# Altium project sensored-bldc-driver-pcb.PrjPcb
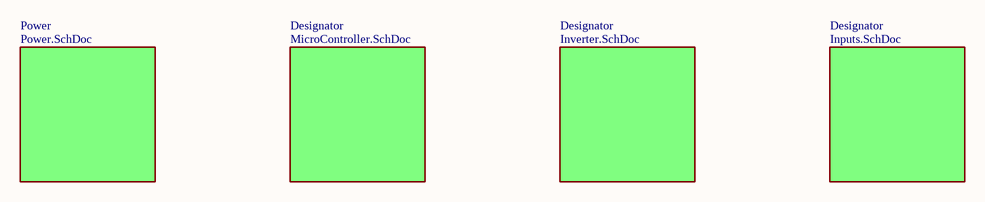
[diagram p0: Sensored BLDC Driver PCB.SchDoc]
5 sheets, 152 parts. Net scope: global (net labels, ports and power ports of the same name join across sheets).
Sheets:
  Sensored BLDC Driver PCB.SchDoc
    Power = Power.SchDoc
    Designator = MicroController.SchDoc
    Designator = Inverter.SchDoc
    Designator = Inputs.SchDoc

## Sheet Sensored BLDC Driver PCB.SchDoc
size A4; SheetNumber: 1; SheetTotal: 5

### Sub-sheets
Designator = MicroController.SchDoc: no entries
Designator = Inverter.SchDoc: no entries
Designator = Inputs.SchDoc: no entries
Power = Power.SchDoc: no entries

## Sheet Power.SchDoc
size A3; SheetNumber: 2; SheetTotal: 5
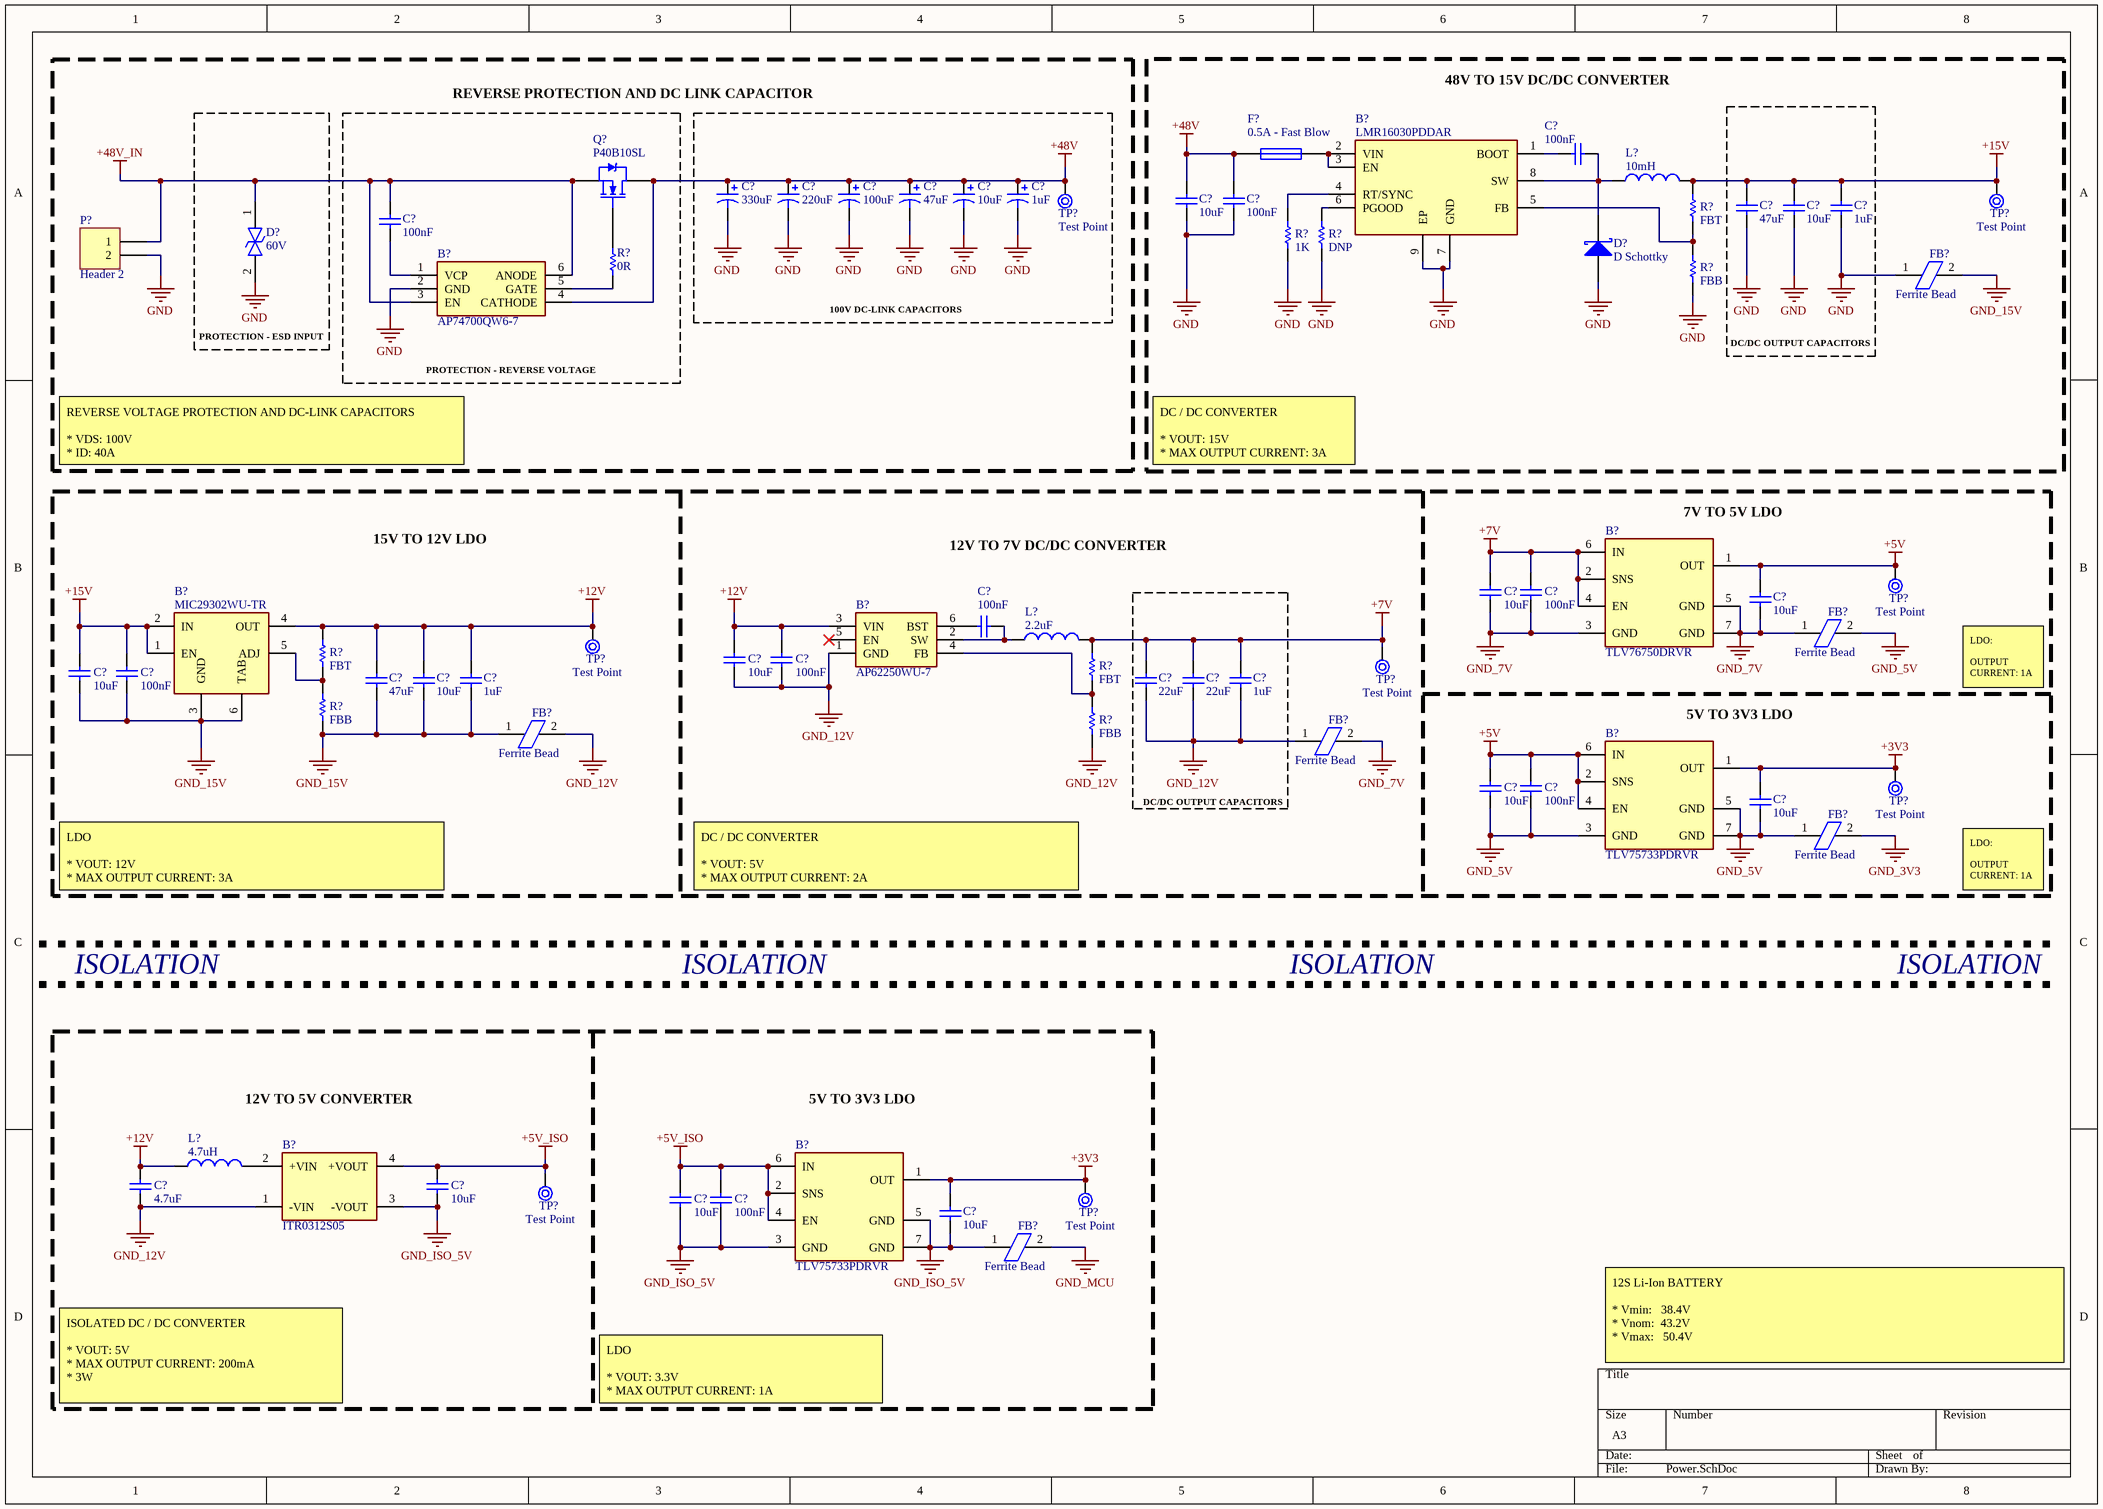
[diagram p1: Power.SchDoc]

### Parts
(Parts that share a designator on the sheet are numbered #1, #2 ... from top to bottom, then left to right.)
B?#1  LMR16030PDDAR
B?#2  AP74700QW6-7
B?#3  TLV76750DRVR  [WSON-6]
B?#4  AP62250WU-7  [TSOT-26-6]
B?#5  MIC29302WU-TR  [TO263-5]
B?#6  TLV75733PDRVR  [WSON-6]
B?#7  TLV75733PDRVR  [WSON-6]
B?#8  ITR0312S05  [SIP-4]
C?#1  value 100nF  (hidden comment: Cap)
C?#2  value 330uF  (hidden comment: Cap Pol2)
C?#3  value 220uF  (hidden comment: Cap Pol2)
C?#4  value 100uF  (hidden comment: Cap Pol2)
C?#5  value 47uF  (hidden comment: Cap Pol2)
C?#6  value 10uF  (hidden comment: Cap Pol2)
C?#7  value 1uF  (hidden comment: Cap Pol2)
C?#8  value 10uF  (hidden comment: Cap)
C?#9  value 100nF  (hidden comment: Cap)
C?#10  value 47uF  (hidden comment: Cap)
C?#11  value 10uF  (hidden comment: Cap)
C?#12  value 1uF  (hidden comment: Cap)
C?#13  value 100nF  (hidden comment: Cap)
C?#14  value 10uF  (hidden comment: Cap)
C?#15  value 100nF  (hidden comment: Cap)
C?#16  value 10uF  (hidden comment: Cap)
C?#17  value 100nF  (hidden comment: Cap)
C?#18  value 10uF  (hidden comment: Cap)
C?#19  value 100nF  (hidden comment: Cap)
C?#20  value 10uF  (hidden comment: Cap)
C?#21  value 100nF  (hidden comment: Cap)
C?#22  value 47uF  (hidden comment: Cap)
C?#23  value 10uF  (hidden comment: Cap)
C?#24  value 1uF  (hidden comment: Cap)
C?#25  value 22uF  (hidden comment: Cap)
C?#26  value 22uF  (hidden comment: Cap)
C?#27  value 1uF  (hidden comment: Cap)
C?#28  value 10uF  (hidden comment: Cap)
C?#29  value 100nF  (hidden comment: Cap)
C?#30  value 10uF  (hidden comment: Cap)
C?#31  value 4.7uF  (hidden comment: Cap)
C?#32  value 10uF  (hidden comment: Cap)
C?#33  value 10uF  (hidden comment: Cap)
C?#34  value 100nF  (hidden comment: Cap)
C?#35  value 10uF  (hidden comment: Cap)
D?#1  60V
D?#2  D Schottky
F?  0.5A - Fast Blow
FB?#1  Ferrite Bead
FB?#2  Ferrite Bead
FB?#3  Ferrite Bead
FB?#4  Ferrite Bead
FB?#5  Ferrite Bead
FB?#6  Ferrite Bead
L?#1  value 10mH  (hidden comment: Inductor)
L?#2  value 2.2uF  (hidden comment: Inductor)
L?#3  value 4.7uH  (hidden comment: Inductor)
P?  Header 2  [HDR1X2]
Q?#1  P40B10SL
R?#1  value FBT  (hidden comment: Res Small)
R?#2  value 0R  (hidden comment: Res Small)
R?#3  value 1K  (hidden comment: Res Small)
R?#4  value DNP  (hidden comment: Res Small)
R?#5  value FBB  (hidden comment: Res Small)
R?#6  value FBT  (hidden comment: Res Small)
R?#7  value FBT  (hidden comment: Res Small)
R?#8  value FBB  (hidden comment: Res Small)
R?#9  value FBB  (hidden comment: Res Small)
TP?#1  Test Point
TP?#2  Test Point
TP?#3  Test Point
TP?#4  Test Point
TP?#5  Test Point
TP?#6  Test Point
TP?#7  Test Point
TP?#8  Test Point

### Blocks framed on the sheet
REVERSE PROTECTION AND DC LINK CAPACITOR: P?
48V TO 15V DC/DC CONVERTER: B?#1 C?#1 C?#8 C?#9 D?#2 F? FB?#1 L?#1 R?#1 R?#3-R?#5 TP?#2
PROTECTION - ESD INPUT: D?#1
PROTECTION - REVERSE VOLTAGE: B?#2 C?#13 Q?#1 R?#2
100V DC-LINK CAPACITORS: C?#2-C?#7 TP?#1
DC/DC OUTPUT CAPACITORS: C?#10-C?#12
DC/DC OUTPUT CAPACITORS: C?#25-C?#27

### Nets
+3V3: B?#6.1(OUT) B?#7.1(OUT) C?#30.1 C?#35.1 TP?#6.1 TP?#8.1
+5V: B?#3.1(OUT) B?#6.2(SNS) B?#6.4(EN) B?#6.6(IN) C?#16.1 C?#28.1 C?#29.1 TP?#3.1
+5V_ISO: B?#7.2(SNS) B?#7.4(EN) B?#7.6(IN) B?#8.4(+VOUT) C?#32.1 C?#33.1 C?#34.1 TP?#7.1
+7V: B?#3.2(SNS) B?#3.4(EN) B?#3.6(IN) C?#14.1 C?#15.1 C?#25.1 C?#26.1 C?#27.1 L?#2.2 R?#7.2 TP?#5.1
+12V: B?#4.3(VIN) B?#5.4(OUT) C?#18.1 C?#19.1 C?#22.1 C?#23.1 C?#24.1 C?#31.1 L?#3.1 R?#6.2 TP?#4.1
+15V: B?#5.1(EN) B?#5.2(IN) C?#10.1 C?#11.1 C?#12.1 C?#20.1 C?#21.1 L?#1.2 R?#1.2 TP?#2.1
+48V: B?#2.4(CATHODE) C?#2.1 C?#3.1 C?#4.1 C?#5.1 C?#6.1 C?#7.1 C?#8.1 C?#9.1 F?.1 Q?#1.2(D) TP?#1.1
+48V_IN: B?#2.3(EN) B?#2.6(ANODE) C?#13.1 D?#1.1 P?.1 Q?#1.3(S)
GND: B?#1.7(GND) B?#1.9(EP) B?#2.2(GND) C?#2.2 C?#3.2 C?#4.2 C?#5.2 C?#6.2 C?#7.2 C?#8.2 C?#9.2 C?#10.2 C?#11.2 C?#12.2 D?#1.2 D?#2.1(A) FB?#1.1 P?.2 R?#3.1 R?#4.1 R?#5.1
GND_3V3: FB?#5.2
GND_5V: B?#6.3(GND) B?#6.5(GND) B?#6.7(GND) C?#28.2 C?#29.2 C?#30.2 FB?#2.2 FB?#5.1
GND_7V: B?#3.3(GND) B?#3.5(GND) B?#3.7(GND) C?#14.2 C?#15.2 C?#16.2 FB?#2.1 FB?#4.2
GND_12V: B?#4.1(GND) B?#8.1(-VIN) C?#18.2 C?#19.2 C?#25.2 C?#26.2 C?#27.2 C?#31.2 FB?#3.2 FB?#4.1 R?#9.1
GND_15V: B?#5.3(GND) B?#5.6(TAB) C?#20.2 C?#21.2 C?#22.2 C?#23.2 C?#24.2 FB?#1.2 FB?#3.1 R?#8.1
GND_ISO_5V: B?#7.3(GND) B?#7.5(GND) B?#7.7(GND) B?#8.3(-VOUT) C?#32.2 C?#33.2 C?#34.2 C?#35.2 FB?#6.1
GND_MCU: FB?#6.2
NetB?#1_1: B?#1.1(BOOT) C?#1.1
NetB?#1_2: B?#1.2(VIN) B?#1.3(EN) F?.2
NetB?#1_4: B?#1.4(RT/SYNC) R?#3.2
NetB?#1_5: B?#1.5(FB) R?#1.1 R?#5.2
NetB?#1_6: B?#1.6(PGOOD) R?#4.2
NetB?#1_8: B?#1.8(SW) C?#1.2 D?#2.2(K) L?#1.1
NetB?#2_1: B?#2.1(VCP) C?#13.2
NetB?#2_5: B?#2.5(GATE) R?#2.2
NetB?#4_2: B?#4.2(SW) C?#17.2 L?#2.1
NetB?#4_4: B?#4.4(FB) R?#7.1 R?#9.2
NetB?#4_6: B?#4.6(BST) C?#17.1
NetB?#5_5: B?#5.5(ADJ) R?#6.1 R?#8.2
NetB?#8_2: B?#8.2(+VIN) L?#3.2
NetQ?#1_1: Q?#1.1(G) R?#2.1

Not connected (* = marked no-connect by the designer): B?#4 5(EN)*

### Notes on the sheet
- REVERSE VOLTAGE PROTECTION AND DC-LINK CAPACITORS
  * VDS: 100V
  * ID: 40A
- DC / DC CONVERTER
  * VOUT: 15V
  * MAX OUTPUT CURRENT: 3A
- (near B?#3) 7V TO 5V LDO
- 15V TO 12V LDO
- 12V TO 7V DC/DC CONVERTER
- (near B?#6) 5V TO 3V3 LDO
- LDO:
  OUTPUT CURRENT: 1A
- LDO
  * VOUT: 12V
  * MAX OUTPUT CURRENT: 3A
- DC / DC CONVERTER
  * VOUT: 5V
  * MAX OUTPUT CURRENT: 2A
- ISOLATION
- 12V TO 5V CONVERTER
- 5V TO 3V3 LDO
- ISOLATED DC / DC CONVERTER
  * VOUT: 5V
  * MAX OUTPUT CURRENT: 200mA
  * 3W
- LDO
  * VOUT: 3.3V
  * MAX OUTPUT CURRENT: 1A
- 12S Li-Ion BATTERY
  * Vmin:   38.4V
  * Vnom:  43.2V
  * Vmax:   50.4V

### Library data of the parts
B?#1 = LMR16030PDDAR: Switching Voltage Regulators SIMPLE SWITCHER 60V, 3A Step-Down Converter with 40uA Iq 8-SO PowerPAD -40 to 125
B?#2 = AP74700QW6-7: Power Switch ICs - Power Distribution Load Switch SOT26 T&R 3K; Manufacturer_Name: Diodes Incorporated; Geometry.Height: 1.4mm; Manufacturer_Part_Number: AP74700QW6-7; Mouser Part Number: 621-AP74700QW6-7; Mouser Price/Stock: https://www.mouser.co.uk/ProductDetail/Diodes-Incorporated/AP74700QW6-7?qs=vvQtp7zwQdPsSFAXTBJZqQ%3D%3D; Arrow Part Number: AP74700QW6-7; Arrow Price/Stock: https://www.arrow.com/en/products/ap74700qw6-7/diodes-incorporated?region=nac; Datasheet Link: https://www.diodes.com//assets/Datasheets/AP74700Q.pdf
B?#3 = TLV76750DRVR: LDO Voltage Regulators Adjustable- and fixed-output, 1-A, 16-V, positive-voltage low-dropout (LDO) linear regulator 6-WSON -40 to 125
B?#4 = AP62250WU-7: Buck Switching Regulator IC Positive Adjustable 0.8V 1 Output 2.5A SOT-23-6 Thin, TSOT-23-6
B?#5 = MIC29302WU-TR: Microchip MIC29302WU-TR, LDO Regulator, 3A Adjustable, +/-2%, 2.25  26 Vin 5-Pin D2PAK; Geometry.Height: 4.597mm; Arrow Price/Stock: https://www.arrow.com/en/products/mic29302wu-tr/microchip-technology?region=nac; Datasheet Link: http://ww1.microchip.com/downloads/en/DeviceDoc/20005685A.pdf
B?#6 B?#7 = TLV75733PDRVR: LDO Voltage Regulators 1-A, low-IQ high-accuracy low-dropout (LDO) voltage regulator with enable 6-WSON -40 to 125
B?#8 = ITR0312S05: Isolated DC/DC Converters - Through Hole DC-DC 3W 10% INPUT; Manufacturer_Name: RECOM Power; Manufacturer_Part_Number: RFM-0505S; Geometry.Height: 10.5mm; Mouser Part Number: 919-RFM-0505S; Mouser Price/Stock: https://www.mouser.co.uk/ProductDetail/RECOM-Power/RFM-0505S?qs=lYGu3FyN48dRVYKTH5ipqg%3D%3D; Arrow Part Number: RFM-0505S; Arrow Price/Stock: https://www.arrow.com/en/products/rfm-0505s/recom-power?region=nac; Datasheet Link: https://www.recom-power.com/pdf/Econoline/RFM.pdf
C?#1 C?#8-C?#35 = Cap: Capacitor; Published: 8-Jun-2000; LatestRevisionDate: 17-Jul-2002; LatestRevisionNote: Re-released for DXP Platform.; PackageReference: RAD-0.3; Publisher: Altium Limited; PackageDescription: Radial Cap, Thru-Hole; 2 Leads; 0.3 in Pin Spacing
C?#2-C?#7 = Cap Pol2: Polarized Capacitor (Axial); Published: 8-Jun-2000; LatestRevisionDate: 17-Jul-2002; LatestRevisionNote: Re-released for DXP Platform.; PackageReference: POLAR0.8; Publisher: Altium Limited; PackageDescription: Polarized Capacitor; 2 Leads
D?#1 = TVS: TVS  / ESD Suppressors Diodes Bi-Directional
D?#2 = D Schottky: Schottky Diode; Published: 8-Jun-2000; LatestRevisionDate: 17-Jul-2002; LatestRevisionNote: Re-released for DXP Platform.; PackageReference: SMB; Publisher: Altium Limited; PackageDescription: DO-214-AA/SMB; 2 C-Bend Leads; Body 5.3 x 3.6 mm, inc. leads (LxW); Code_JEDEC: DO-214-AA
F? = Fuse 1: Fuse; Published: 8-Jun-2000; LatestRevisionDate: 17-Jul-2002; LatestRevisionNote: Re-released for DXP Platform.; PackageReference: PIN-W2/E2.8; Publisher: Altium Limited; PackageDescription: Thru-Hole; 2 Leads
L?#1-L?#3 = Inductor: Code_IEC: 1005; Published: 8-Jun-2000; LatestRevisionDate: 29-May-2009; LatestRevisionNote: IPC-7351 Footprint Added.; PackageReference: 0402-A; Publisher: Altium Limited; PackageDescription: Chip Inductor; Code_JEITA: 0402
P? = Header 2: Header, 2-Pin; LatestRevisionDate: 17-Jul-2002; LatestRevisionNote: Re-released for DXP Platform.; Publisher: Altium Limited
Q?#1 = NMOS-2: N-Channel Power MOSFET; Note: Pin 2 is electrically connected to pin 4.; Published: 8-Jun-2000; LatestRevisionDate: 17-Jul-2002; LatestRevisionNote: Re-released for DXP Platform.; DatasheetVersion: PD-9.814; PackageVersion: Feb-1997; PackageReference: TO-220AB; Publisher: Altium Limited; PackageDescription: TO, Thru-Hole, Vertical, Heatsink Mounted; 3 In-Line Leads; Pitch 2.54 mm; ComponentLink1Description: Manufacturer Link; ComponentLink1URL: http://www.irf.com/
R?#1-R?#9 = Res Small: Resistor; Published: 8-Jun-2000; LatestRevisionDate: 17-Jul-2002; LatestRevisionNote: Re-released for DXP Platform.; PackageReference: AXIAL-0.3; Publisher: Altium Limited; PackageDescription: Axial Device, Thru-Hole; 2 Leads; 0.3 in Pin Spacing

## Sheet MicroController.SchDoc
size A4; SheetNumber: 3; SheetTotal: 5

## Sheet Inverter.SchDoc
size A3 portrait; SheetNumber: 5; SheetTotal: 5
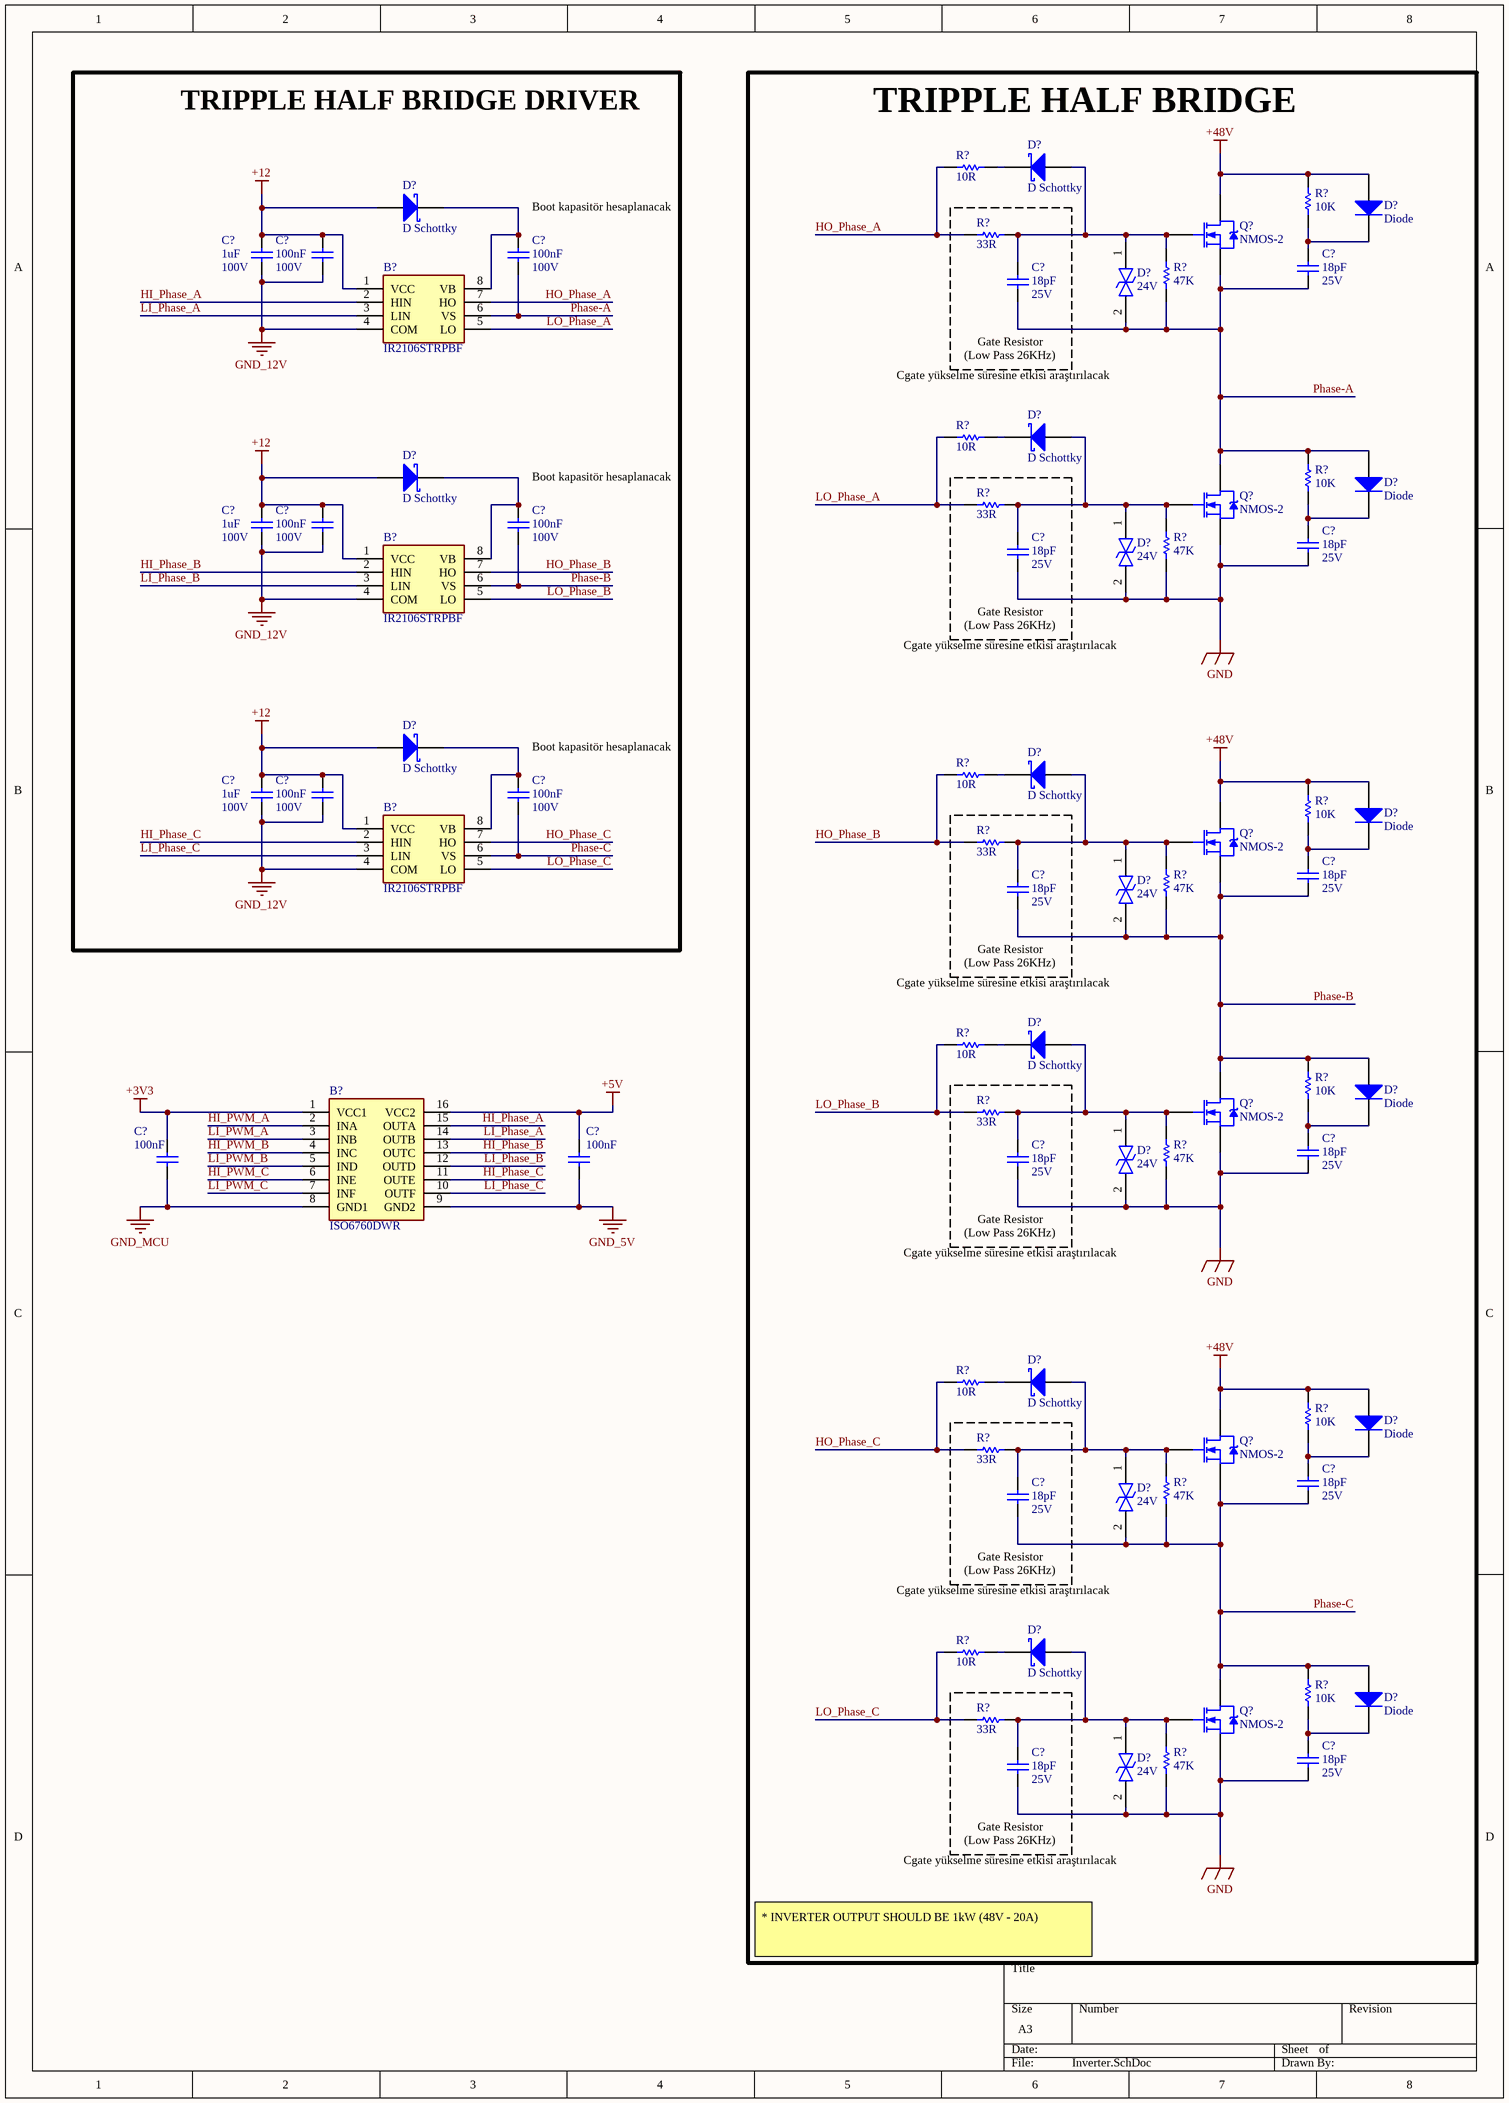
[diagram p2: Inverter.SchDoc]

### Parts
(Parts that share a designator on the sheet are numbered #1, #2 ... from top to bottom, then left to right.)
B?#9  IR2106STRPBF  [SOIC-8]
B?#10  IR2106STRPBF  [SOIC-8]
B?#11  IR2106STRPBF  [SOIC-8]
B?#12  ISO6760DWR  [SOIC-16N]
C?#36  value 1uF  Voltage: 100V  (hidden comment: Cap)
C?#37  value 100nF  Voltage: 100V  (hidden comment: Cap)
C?#38  value 100nF  Voltage: 100V  (hidden comment: Cap)
C?#39  value 18pF  Voltage: 25V  (hidden comment: Cap)
C?#40  value 18pF  Voltage: 25V  (hidden comment: Cap)
C?#41  value 1uF  Voltage: 100V  (hidden comment: Cap)
C?#42  value 100nF  Voltage: 100V  (hidden comment: Cap)
C?#43  value 100nF  Voltage: 100V  (hidden comment: Cap)
C?#44  value 18pF  Voltage: 25V  (hidden comment: Cap)
C?#45  value 18pF  Voltage: 25V  (hidden comment: Cap)
C?#46  value 1uF  Voltage: 100V  (hidden comment: Cap)
C?#47  value 100nF  Voltage: 100V  (hidden comment: Cap)
C?#48  value 100nF  Voltage: 100V  (hidden comment: Cap)
C?#49  value 18pF  Voltage: 25V  (hidden comment: Cap)
C?#50  value 18pF  Voltage: 25V  (hidden comment: Cap)
C?#51  value 18pF  Voltage: 25V  (hidden comment: Cap)
C?#52  value 100nF  (hidden comment: Cap)
C?#53  value 100nF  (hidden comment: Cap)
C?#54  value 18pF  Voltage: 25V  (hidden comment: Cap)
C?#55  value 18pF  Voltage: 25V  (hidden comment: Cap)
C?#56  value 18pF  Voltage: 25V  (hidden comment: Cap)
C?#57  value 18pF  Voltage: 25V  (hidden comment: Cap)
C?#58  value 18pF  Voltage: 25V  (hidden comment: Cap)
D?#3  D Schottky
D?#4  D Schottky
D?#5  Diode
D?#6  24V
D?#7  D Schottky
D?#8  D Schottky
D?#9  Diode
D?#10  24V
D?#11  D Schottky
D?#12  D Schottky
D?#13  Diode
D?#14  24V
D?#15  D Schottky
D?#16  Diode
D?#17  24V
D?#18  D Schottky
D?#19  Diode
D?#20  24V
D?#21  D Schottky
D?#22  Diode
D?#23  24V
Q?#2  NMOS-2
Q?#3  NMOS-2
Q?#4  NMOS-2
Q?#5  NMOS-2
Q?#6  NMOS-2
Q?#7  NMOS-2
R?#10  value 10R  (hidden comment: Res Small)
R?#11  value 10K  (hidden comment: Res Small)
R?#12  value 33R  (hidden comment: Res Small)
R?#13  value 47K  (hidden comment: Res Small)
R?#14  value 10R  (hidden comment: Res Small)
R?#15  value 10K  (hidden comment: Res Small)
R?#16  value 33R  (hidden comment: Res Small)
R?#17  value 47K  (hidden comment: Res Small)
R?#18  value 10R  (hidden comment: Res Small)
R?#19  value 10K  (hidden comment: Res Small)
R?#20  value 33R  (hidden comment: Res Small)
R?#21  value 47K  (hidden comment: Res Small)
R?#22  value 10R  (hidden comment: Res Small)
R?#23  value 10K  (hidden comment: Res Small)
R?#24  value 33R  (hidden comment: Res Small)
R?#25  value 47K  (hidden comment: Res Small)
R?#26  value 10R  (hidden comment: Res Small)
R?#27  value 10K  (hidden comment: Res Small)
R?#28  value 33R  (hidden comment: Res Small)
R?#29  value 47K  (hidden comment: Res Small)
R?#30  value 10R  (hidden comment: Res Small)
R?#31  value 10K  (hidden comment: Res Small)
R?#32  value 33R  (hidden comment: Res Small)
R?#33  value 47K  (hidden comment: Res Small)

### Blocks framed on the sheet
TRIPPLE HALF BRIDGE DRIVER: B?#9-B?#11 C?#36-C?#38 C?#41-C?#43 C?#46-C?#48 D?#4 D?#8 D?#11
TRIPPLE HALF BRIDGE: C?#39 C?#40 C?#44 C?#45 C?#49-C?#51 C?#54-C?#58 D?#3 D?#5-D?#7 D?#9 D?#10 D?#12-D?#23 Q?#2-Q?#7 R?#10-R?#33

### Nets
+3V3: B?#12.1(VCC1) C?#52.2
+5V: B?#12.16(VCC2) C?#53.2
+12: B?#9.1(VCC) B?#10.1(VCC) B?#11.1(VCC) C?#36.2 C?#37.2 C?#41.2 C?#42.2 C?#46.2 C?#47.2 D?#4.1(A) D?#8.1(A) D?#11.1(A)
+48V: D?#5.1(A) D?#13.1(A) D?#19.1(A) Q?#2.2(D) Q?#4.2(D) Q?#6.2(D) R?#11.2 R?#19.2 R?#27.2
GND: C?#44.1 C?#45.1 C?#51.1 C?#54.1 C?#57.1 C?#58.1 D?#10.2 D?#17.2 D?#23.2 Q?#3.3(S) Q?#5.3(S) Q?#7.3(S) R?#17.1 R?#25.1 R?#33.1
GND_5V: B?#12.9(GND2) C?#53.1
GND_12V: B?#9.4(COM) B?#10.4(COM) B?#11.4(COM) C?#36.1 C?#37.1 C?#41.1 C?#42.1 C?#46.1 C?#47.1
GND_MCU: B?#12.8(GND1) C?#52.1
HI_Phase_A: B?#9.2(HIN) B?#12.15(OUTA)
HI_Phase_B: B?#10.2(HIN) B?#12.13(OUTC)
HI_Phase_C: B?#11.2(HIN) B?#12.11(OUTE)
HI_PWM_A: B?#12.2(INA)
HI_PWM_B: B?#12.4(INC)
HI_PWM_C: B?#12.6(INE)
HO_Phase_A: B?#9.7(HO) R?#10.2 R?#12.2
HO_Phase_B: B?#10.7(HO) R?#18.2 R?#20.2
HO_Phase_C: B?#11.7(HO) R?#26.2 R?#28.2
LI_Phase_A: B?#9.3(LIN) B?#12.14(OUTB)
LI_Phase_B: B?#10.3(LIN) B?#12.12(OUTD)
LI_Phase_C: B?#11.3(LIN) B?#12.10(OUTF)
LI_PWM_A: B?#12.3(INB)
LI_PWM_B: B?#12.5(IND)
LI_PWM_C: B?#12.7(INF)
LO_Phase_A: B?#9.5(LO) R?#14.2 R?#16.2
LO_Phase_B: B?#10.5(LO) R?#22.2 R?#24.2
LO_Phase_C: B?#11.5(LO) R?#30.2 R?#32.2
Phase-A: B?#9.6(VS) C?#38.1 C?#39.1 C?#40.1 D?#6.2 D?#9.1(A) Q?#2.3(S) Q?#3.2(D) R?#13.1 R?#15.2
Phase-B: B?#10.6(VS) C?#43.1 C?#49.1 C?#50.1 D?#14.2 D?#16.1(A) Q?#4.3(S) Q?#5.2(D) R?#21.1 R?#23.2
Phase-C: B?#11.6(VS) C?#48.1 C?#55.1 C?#56.1 D?#20.2 D?#22.1(A) Q?#6.3(S) Q?#7.2(D) R?#29.1 R?#31.2
NetB?#9_8: B?#9.8(VB) C?#38.2 D?#4.2(K)
NetB?#10_8: B?#10.8(VB) C?#43.2 D?#8.2(K)
NetB?#11_8: B?#11.8(VB) C?#48.2 D?#11.2(K)
NetC?#39_2: C?#39.2 D?#5.2(K) R?#11.1
NetC?#40_2: C?#40.2 D?#3.1(A) D?#6.1 Q?#2.1(G) R?#12.1 R?#13.2
NetC?#44_2: C?#44.2 D?#9.2(K) R?#15.1
NetC?#45_2: C?#45.2 D?#7.1(A) D?#10.1 Q?#3.1(G) R?#16.1 R?#17.2
NetC?#49_2: C?#49.2 D?#13.2(K) R?#19.1
NetC?#50_2: C?#50.2 D?#12.1(A) D?#14.1 Q?#4.1(G) R?#20.1 R?#21.2
NetC?#51_2: C?#51.2 D?#16.2(K) R?#23.1
NetC?#54_2: C?#54.2 D?#15.1(A) D?#17.1 Q?#5.1(G) R?#24.1 R?#25.2
NetC?#55_2: C?#55.2 D?#19.2(K) R?#27.1
NetC?#56_2: C?#56.2 D?#18.1(A) D?#20.1 Q?#6.1(G) R?#28.1 R?#29.2
NetC?#57_2: C?#57.2 D?#22.2(K) R?#31.1
NetC?#58_2: C?#58.2 D?#21.1(A) D?#23.1 Q?#7.1(G) R?#32.1 R?#33.2
NetD?#3_2: D?#3.2(K) R?#10.1
NetD?#7_2: D?#7.2(K) R?#14.1
NetD?#12_2: D?#12.2(K) R?#18.1
NetD?#15_2: D?#15.2(K) R?#22.1
NetD?#18_2: D?#18.2(K) R?#26.1
NetD?#21_2: D?#21.2(K) R?#30.1

### Notes on the sheet
- (near C?#38) Boot kapasitör hesaplanacak
- (Low Pass 26KHz)
- (near C?#40) Gate Resistor
- Cgate yükselme süresine etkisi araştırılacak
- (near C?#43) Boot kapasitör hesaplanacak
- (near C?#45) Gate Resistor
- (near C?#48) Boot kapasitör hesaplanacak
- (near C?#50) Gate Resistor
- (near C?#54) Gate Resistor
- (near C?#56) Gate Resistor
- (near C?#58) Gate Resistor
- * INVERTER OUTPUT SHOULD BE 1kW (48V - 20A)

### Library data of the parts
B?#9-B?#11 = IR2106STRPBF: INFINEON - IR2106STRPBF - MOSFET Driver, 2 outputs, High Side and Low Side, 10V-20V supply, 350 mA output, SOIC-8; Geometry.Height: 1.75mm; Manufacturer_Name: Infineon; Manufacturer_Part_Number: IR2106STRPBF; Mouser Part Number: 942-IR2106STRPBF; Mouser Price/Stock: https://www.mouser.co.uk/ProductDetail/Infineon-Technologies/IR2106STRPBF?qs=2r01AXMCG3OwYry05S78qA%3D%3D; Arrow Part Number: IR2106STRPBF; Arrow Price/Stock: https://www.arrow.com/en/products/ir2106strpbf/infineon-technologies-ag?region=nac; Datasheet Link: https://www.mouser.in/datasheet/2/196/Infineon_ir2106_DS_v01_00_EN-1732317.pdf
B?#12 = ISO6760DWR: CAN, RS232, RS485, SPI Digital Isolator 5000Vrms 6 Channel 50Mbps 50kV/s CMTI 16-SOIC (0.295", 7.50mm Width)
C?#36-C?#58 = Cap: Capacitor; Published: 8-Jun-2000; LatestRevisionDate: 17-Jul-2002; LatestRevisionNote: Re-released for DXP Platform.; PackageReference: RAD-0.3; Publisher: Altium Limited; PackageDescription: Radial Cap, Thru-Hole; 2 Leads; 0.3 in Pin Spacing
D?#3 D?#4 D?#7 D?#8 D?#11 D?#12 D?#15 D?#18 D?#21 = D Schottky: Schottky Diode; Published: 8-Jun-2000; LatestRevisionDate: 17-Jul-2002; LatestRevisionNote: Re-released for DXP Platform.; PackageReference: SMB; Publisher: Altium Limited; PackageDescription: DO-214-AA/SMB; 2 C-Bend Leads; Body 5.3 x 3.6 mm, inc. leads (LxW); Code_JEDEC: DO-214-AA
D?#5 D?#9 D?#13 D?#16 D?#19 D?#22 = Diode: Default Diode; Published: 8-Jun-2000; LatestRevisionDate: 17-Jul-2002; LatestRevisionNote: Re-released for DXP Platform.; PackageVersion: Sep-1996; PackageReference: SMC; Publisher: Altium Limited; PackageDescription: DO-214-AB/SMC; 2 C-Bend Leads; Body 7.9 x 5.9 mm, inc. leads (LxW); Code_JEDEC: DO-214-AB
D?#6 D?#10 D?#14 D?#17 D?#20 D?#23 = TVS: as D?#1 on sheet Power
Q?#2-Q?#7 = NMOS-2: as Q?#1 on sheet Power; Published: 8-Jun-2000; LatestRevisionDate: 17-Jul-2002; LatestRevisionNote: Re-released for DXP Platform.; DatasheetVersion: PD-9.814; PackageVersion: Feb-1997; PackageReference: TO-220AB; Publisher: Altium Limited; PackageDescription: TO, Thru-Hole, Vertical, Heatsink Mounted; 3 In-Line Leads; Pitch 2.54 mm; ComponentLink1Description: Manufacturer Link; ComponentLink1URL: http://www.irf.com/
R?#10-R?#33 = Res Small: Resistor; Published: 8-Jun-2000; LatestRevisionDate: 17-Jul-2002; LatestRevisionNote: Re-released for DXP Platform.; PackageReference: AXIAL-0.3; Publisher: Altium Limited; PackageDescription: Axial Device, Thru-Hole; 2 Leads; 0.3 in Pin Spacing

## Sheet Inputs.SchDoc
size A4; SheetNumber: 4; SheetTotal: 4

## Nets that join several sheets
+3V3: Power (6 pins), Inverter (B?#12.1 C?#52.2)
+5V: Power (8 pins), Inverter (B?#12.16 C?#53.2)
+48V: Power (12 pins), Inverter (9 pins)
GND: Power (21 pins), Inverter (15 pins)
GND_5V: Power (8 pins), Inverter (B?#12.9 C?#53.1)
GND_12V: Power (11 pins), Inverter (9 pins)
GND_MCU: Power (FB?#6.2), Inverter (B?#12.8 C?#52.1)